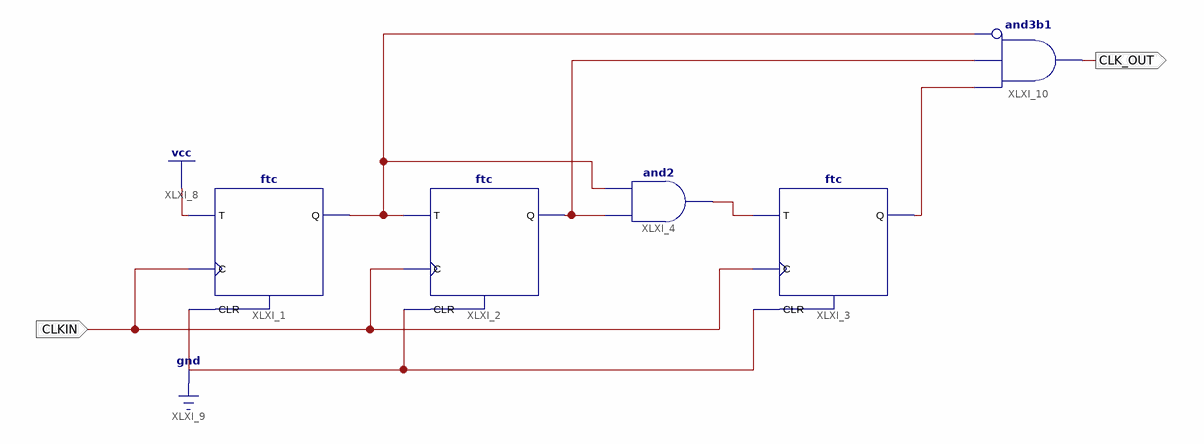
[diagram p0: schematic sheet 1]
// Xilinx ISE schematic Div6.sch (spartan6) as structural Verilog: 5 symbols, 2 ports
module Div6 (
  input  CLKIN,
  output CLK_OUT
);

  wire XLXN_1, XLXN_3, XLXN_4, XLXN_6;

  ftc XLXI_1 (.C(CLKIN), .CLR(1'b0), .T(1'b1), .Q(XLXN_6));
  ftc XLXI_2 (.C(CLKIN), .CLR(1'b0), .T(XLXN_6), .Q(XLXN_4));
  ftc XLXI_3 (.C(CLKIN), .CLR(1'b0), .T(XLXN_1), .Q(XLXN_3));
  and XLXI_4 (XLXN_1, XLXN_4, XLXN_6);
  and XLXI_10 (CLK_OUT, ~XLXN_6, XLXN_4, XLXN_3);  // and3b1
endmodule
